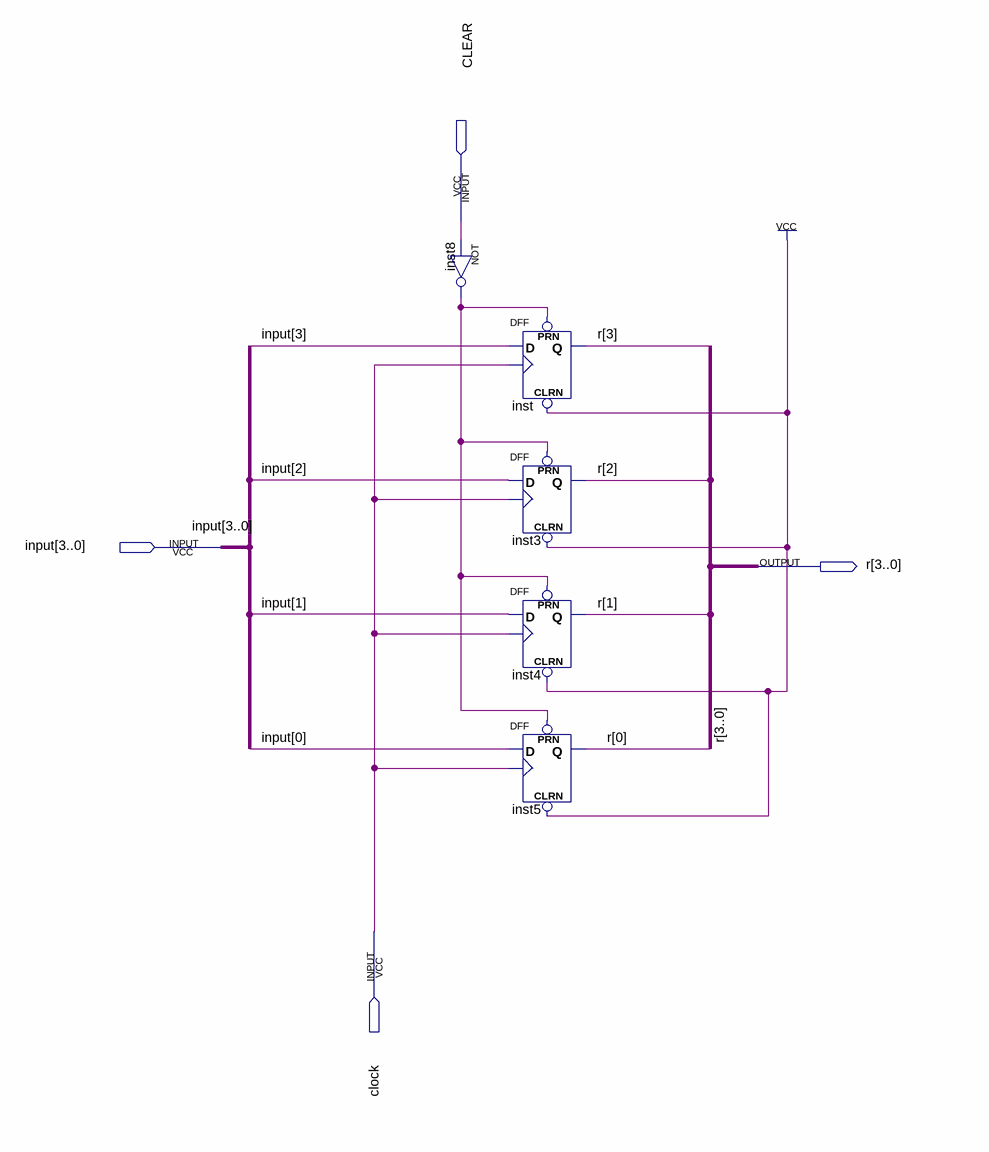
[diagram p0: schematic sheet]
// Quartus schematic reg.bdf as structural Verilog: 5 symbols, 4 pins
module \reg  (
  input  CLEAR,
  input  [3:0] \input ,
  input  clock,
  output [3:0] r
);

  wire inst8_out;

  not inst8 (inst8_out, CLEAR);
  DFF inst (.CLRN(1'b1), .CLK(clock), .D(\input [3]), .PRN(inst8_out), .Q(r[3]));
  DFF inst3 (.CLRN(1'b1), .CLK(clock), .D(\input [2]), .PRN(inst8_out), .Q(r[2]));
  DFF inst4 (.CLRN(1'b1), .CLK(clock), .D(\input [1]), .PRN(inst8_out), .Q(r[1]));
  DFF inst5 (.CLRN(1'b1), .CLK(clock), .D(\input [0]), .PRN(inst8_out), .Q(r[0]));
endmodule
